# EAGLE design can_skin (EAGLE 7.1.0)
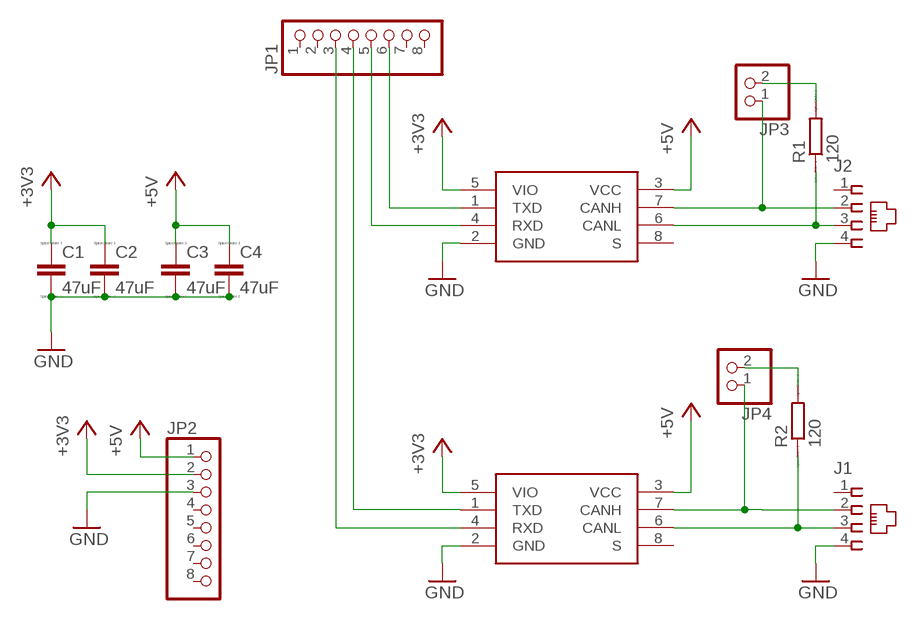
[diagram p0: schematic, sheet 1]

## Parts
C1  47uF  C-EUC3216  [C3216]
C2  47uF  C-EUC3216  [C3216]
C3  47uF  C-EUC3216  [C3216]
C4  47uF  C-EUC3216  [C3216]
J1  215875-3  [215875-3]
J2  215875-3  [215875-3]
JP1  PINHD-1X8  [1X08]
JP2  PINHD-1X8  [1X08]
JP3  PINHD-1X2  [1X02]
JP4  PINHD-1X2  [1X02]
R1  120  R-EU_M3216  [M3216]
R2  120  R-EU_M3216  [M3216]
U1  TJA1051T/3  [SOIC127P600X175-8N]
U2  TJA1051T/3  [SOIC127P600X175-8N]

## Nets
+3V3 [Power]: C1.1 C2.1 JP2.2 U1.5(VIO) U2.5(VIO)
+5V [Power]: C3.1 C4.1 JP2.1 U1.3(VCC) U2.3(VCC)
GND [Power]: C1.2 C2.2 C3.2 C4.2 J1.4 J2.4 JP2.3 U1.2(GND) U2.2(GND)
N$1: J1.2 JP4.1 U1.7(CANH)
N$2: J1.3 R2.1 U1.6(CANL)
N$3: JP1.5 U2.4(RXD)
N$4: J2.3 R1.1 U2.6(CANL)
N$5: J2.2 JP3.1 U2.7(CANH)
N$6: JP4.2 R2.2
N$7: JP3.2 R1.2
N$8: JP1.6 U2.1(TXD)
N$15: JP1.3 U1.4(RXD)
N$16: JP1.4 U1.1(TXD)
Unconnected: J1.1 J2.1 JP1.1 JP1.2 JP1.7 JP1.8 JP2.4 JP2.5 JP2.6 JP2.7 JP2.8 U1.8(S) U2.8(S)

## Library data of the parts
C1-C4 = resistor:C-EU: CAPACITOR, European symbol; SPICEPREFIX: C
J1 J2 = con-amp:215875-3: AMP connector
JP1 JP2 = pinhead:PINHD-1X8: PIN HEADER
JP3 JP4 = pinhead:PINHD-1X2: PIN HEADER
R1 R2 = resistor:R-EU_: RESISTOR, European symbol; SPICEPREFIX: R
U1 U2 = NXP_By_element14_Batch_1:TJA1051T/3: High speed CAN transceiver; MPN: TJA1051T/3; OC_FARNELL: -; OC_NEWARK: 99R3114; PACKAGE: SOIC-8; SUPPLIER: NXP Semiconductor

## Net classes
0 default: width 0.152 mm, drill 0.33 mm, clearance 0.152 mm
1 Power: width 0.762 mm, drill 0.33 mm, clearance 0.152 mm

## Board
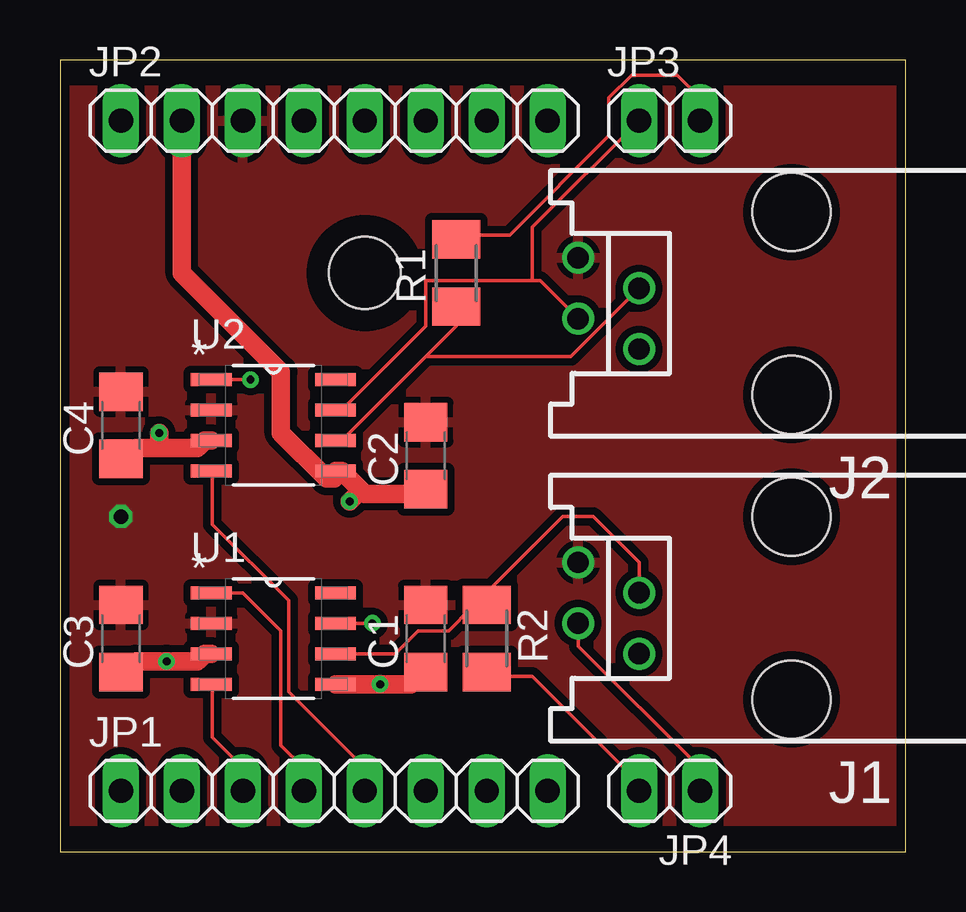
[diagram p1: board, top side]
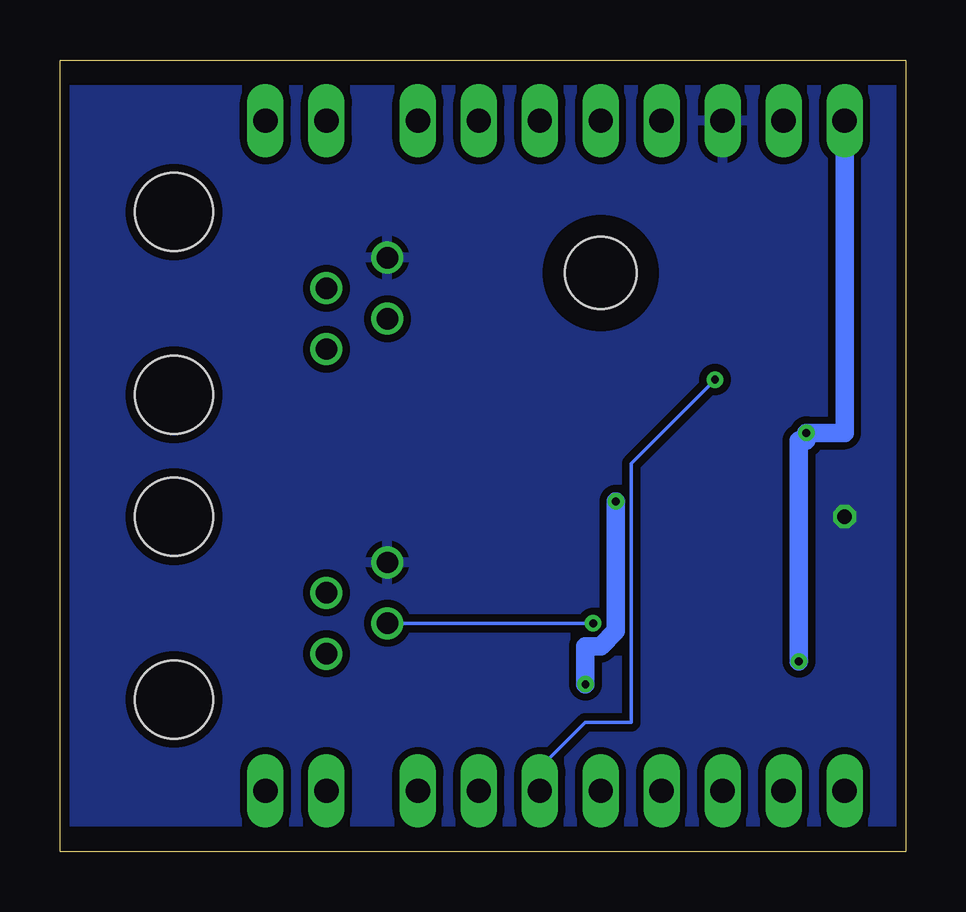
[diagram p2: board, bottom side, seen from below]

Size 35.23 x 33.01 mm. Coordinates in mm from the lower left corner, seen from the top.
Outline: 0,0 35.23,0 35.23,33.01 0,33.01 0,0
Copper layers (1*16): Top 0.0356mm / dielectric 1.5011mm / Bottom 0.0356mm
Design rules "LaenPCBOrder": minimum track width 6mil, minimum drill 13mil, track to track 6mil, track to pad 6mil, pad to pad 6mil, via to via 6mil, smd to smd 6mil, copper to edge 15mil, drill to drill 6mil, minimum pad ring 7mil, minimum via ring 7mil, stop-mask expansion 3mil, vias tented up to drill 0mil, thermal gap 10mil
Holes 3 mm at 12.7,24.13
tRestrict: area 10.8,22.2 to 14.6,26; area 10.8,22.2 to 14.6,26
bRestrict: area 10.8,22.2 to 14.6,26

### Footprints (pad centres in the part's own frame; a part is rotated, then mirrored left to right if it is on the bottom)
C3216 = smd 1.6 x 1.8: 1 -1.4,0; 2 1.4,0
215875-3 = drill 0.889: 1 -1.905,6.35; 2 -0.635,8.89; 3 0.635,6.35; 4 1.905,8.89 | hole 3.251: -3.81,0; 3.81,0
1X08 = drill 1.016 long: 1 -8.89,0; 2 -6.35,0; 3 -3.81,0; 4 -1.27,0; 5 1.27,0; 6 3.81,0; 7 6.35,0; 8 8.89,0
1X02 = drill 1.016 long: 1 -1.27,0; 2 1.27,0
M3216 = smd 1.6 x 2: 1 -1.4,0; 2 1.4,0
SOIC127P600X175-8N = smd 1.702 x 0.533: 1 -2.591,1.905; 2 -2.591,0.635; 3 -2.591,-0.635; 4 -2.591,-1.905; 5 2.591,-1.905; 6 2.591,-0.635; 7 2.591,0.635; 8 2.591,1.905

### Placement (x,y rotation side)
C1  15.24,8.89 90 top
C2  15.24,16.51 90 top
C3  2.54,8.89 90 top
C4  2.54,17.78 90 top
J1  30.48,10.16 90 top
J2  30.48,22.86 90 top
JP1  11.43,2.54 0 top
JP2  11.43,30.48 0 top
JP3  25.4,30.48 0 top
JP4  25.4,2.54 180 top
R1  16.51,24.13 90 top
R2  17.78,8.89 270 top
U1  8.89,8.89 0 top
U2  8.89,17.78 0 top

### Tracks (layer width: path | path; a pad name or v marks a point on that pad's centre or on a via)
+3V3  (via drill 0.33)
  Top 0.762: U1.5 v13.34,6.99 14.61,6.99 15.24,7.62 C1.1 | 12.54,15.08 12.7,14.92 15.24,14.92 C2.1 | 12.54,15.08 11.75,15.88 U2.5 11.43,15.56 11.11,15.56 9.21,17.46 9.21,20 5.08,24.13 JP2.2 | 12.54,15.08 v12.06,14.61
  Bottom 0.762: v13.34,6.99 13.34,8.57 12.7,8.57 12.06,9.21 v12.06,14.61
+5V  (via drill 0.33)
  Top 0.762: U1.3 6.03,8.26 5.71,7.94 v4.45,7.94 3.17,7.94 2.54,7.3 C3.1 | 4.13,16.83 3.17,16.83 2.54,16.19 C4.1 | 4.13,16.83 5.71,16.83 6.03,17.14 U2.3 | v4.13,17.46 4.13,16.83
  Bottom 0.762: JP2.1 2.54,17.46 v4.13,17.46 4.13,17.14 4.45,17.14 v4.45,7.94
GND  (via drill 0.6)
  other vias: 2.54,13.97
  pour Bottom (isolate 0.305): 0,1.27 0,31.75 35.56,31.75 35.56,1.27
  pour Top (isolate 0.305): 0,1.27 0,31.75 35.56,31.75 35.56,1.27
N$1  (via drill 0.33)
  Top 0.152: v13.02,9.53 U1.7 | JP4.1 26.67,3.49 21.59,8.57 J1.2
  Bottom 0.152: J1.2 v13.02,9.53
N$2
  Top 0.152: U1.6 13.97,8.26 14.92,9.21 16.19,9.21 17.14,10.16 | 17.14,10.16 17.78,10.16 R2.1 17.14,10.16 | J1.3 24.13,12.06 22.23,13.97 20.95,13.97 17.14,10.16
N$3
  Top 0.152: JP1.5 12.7,3.49 9.53,6.67 9.53,10.48 6.35,13.65 6.35,15.88 U2.4
N$4
  Top 0.152: 15.24,20.64 16.51,21.91 R1.1 | 15.24,20.64 11.75,17.14 U2.6 | J2.3 21.27,20.64 15.24,20.64
N$5
  Top 0.152: 19.68,23.81 20,23.81 J2.2 | 19.68,23.81 15.24,23.81 15.24,21.91 11.75,18.41 U2.7 | JP3.1 19.68,26.04 19.68,23.81
N$6
  Top 0.152: JP4.2 24.13,2.86 19.68,7.3 17.78,7.3 R2.2
N$7
  Top 0.152: JP3.2 26.67,31.43 25.72,32.38 23.81,32.38 22.86,31.43 22.86,29.84 18.73,25.72 16.51,25.72 R1.2
N$8  (via drill 0.33)
  Top 0.152: v7.94,19.68 U2.1
  Bottom 0.152: v7.94,19.68 11.43,16.19 11.43,5.4 13.34,5.4 15.24,3.49 JP1.6
N$15
  Top 0.152: JP1.3 7.62,3.49 6.35,4.76 6.35,6.99 U1.4
N$16
  Top 0.152: U1.1 7.62,10.79 9.21,9.21 9.21,4.45 10.16,3.49 JP1.4